# EAGLE schematic Frequency_Board (EAGLE 9.5.2)
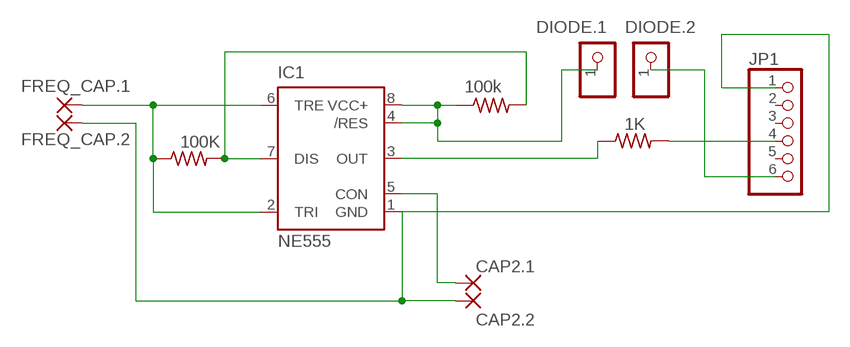
[diagram p0: schematic, sheet 1]

## Parts
1K  R-US_0204/5  [0204/5]
100K  R-US_0204/5  [0204/5]
CAP2.1  1,6/0,8  [1,6/0,8]
CAP2.2  1,6/0,8  [1,6/0,8]
DIODE.1  PINHD-1X1  [1X01]
DIODE.2  PINHD-1X1  [1X01]
FREQ_CAP.1  1,6/0,8  [1,6/0,8]
FREQ_CAP.2  1,6/0,8  [1,6/0,8]
IC1  NE555  [DIL-08]
JP1  PINHD-1X6  [1X06]
R1  100k  R-US_0204/5  [0204/5]

## Nets
N$1: DIODE.1.1 IC1.4(/RES) IC1.8(VCC+) R1.1
N$2: 100K.2 IC1.7(DIS) R1.2
N$3: 100K.1 FREQ_CAP.1.1(P) IC1.2(TRI) IC1.6(TRE)
N$4: CAP2.2.1(P) FREQ_CAP.2.1(P) IC1.1(GND) JP1.1
N$5: CAP2.1.1(P) IC1.5(CON)
N$6: DIODE.2.1 JP1.6
N$7: 1K.1 IC1.3(OUT)
N$8: 1K.2 JP1.4
Unconnected: JP1.2 JP1.3 JP1.5

## Library data of the parts
1K 100K R1 = BeagleBone_Black_Wireless:R-US_: RESISTOR, American symbol
CAP2.1 CAP2.2 FREQ_CAP.1 FREQ_CAP.2 = wirepad:1,6/0,8: THROUGH-HOLE PAD
DIODE.1 DIODE.2 = adafruit:PINHD-1X1: Pin header 1x1 for 0.1" spacing With round pins
IC1 = st-microelectronics:NE555: General purpose bipolar Timer; MF: Arrow Electronics; MPN: NE555N; OC_FARNELL: 1467742; OC_NEWARK: 89K1486
JP1 = adafruit:PINHD-1X6: PIN HEADER